# Altium schematic sheet main.SchDoc: SSSSS
size A4; Date: 24.07.2024; Author: Samet Akyol; Revision: 0.1; SheetNumber: 1; SheetTotal: 3
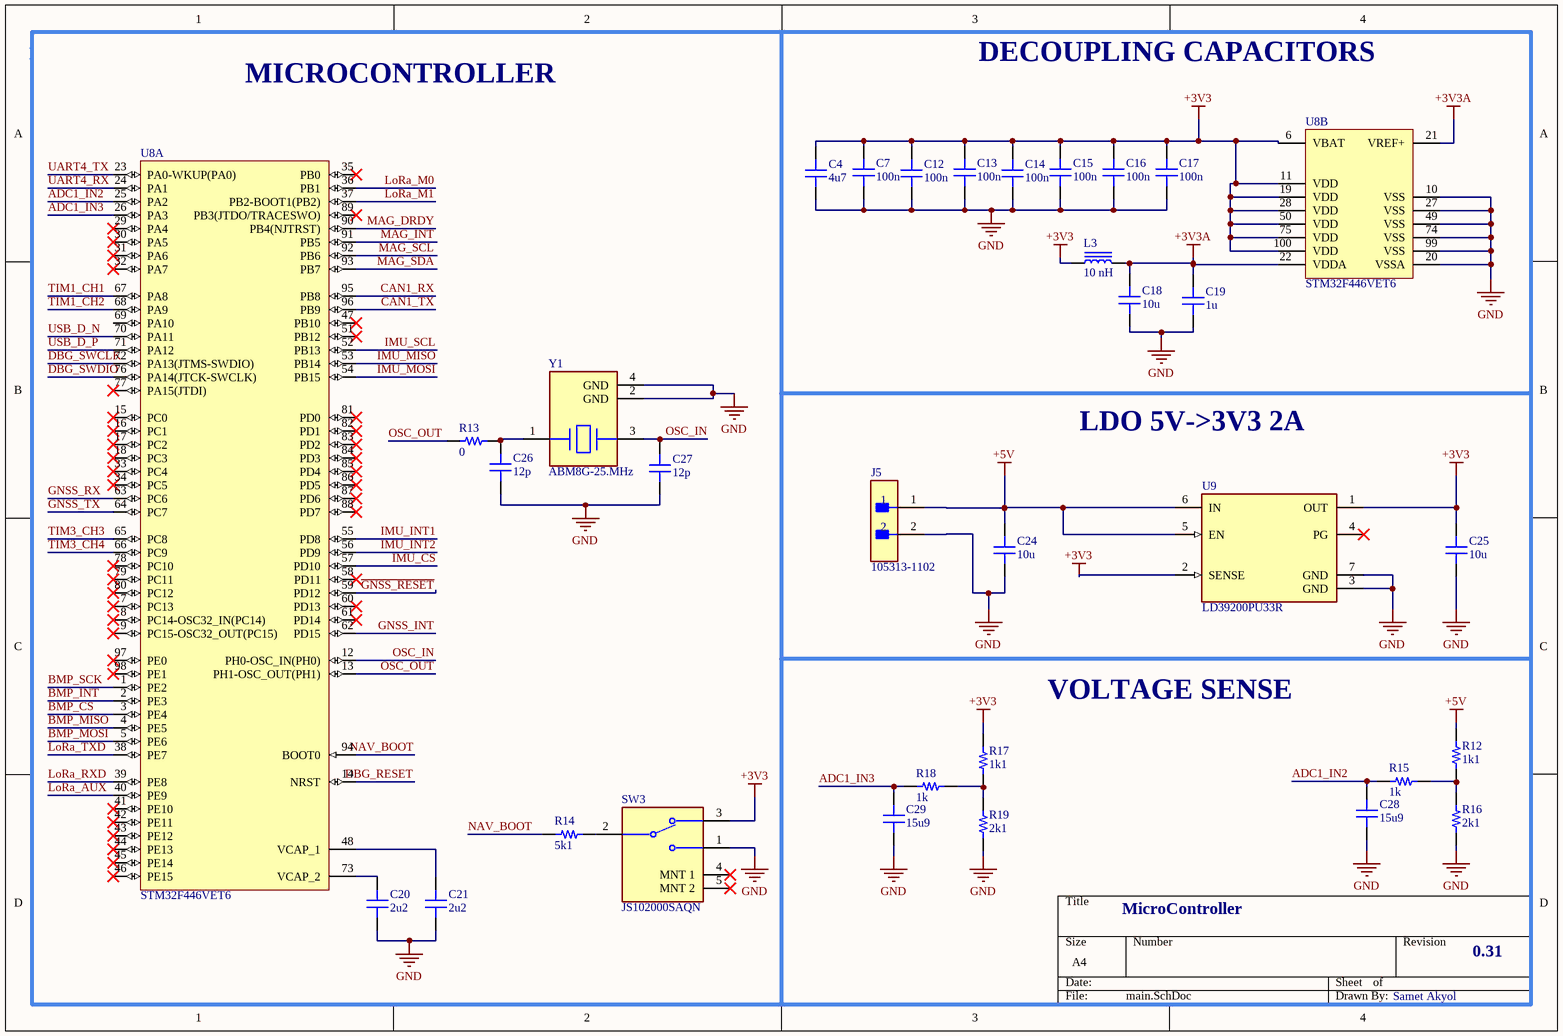
[diagram p0: main.SchDoc]

## Parts
C4  4u7  [CAP 0402_1005]
C7  100n  [CAP 0402_1005]
C12  100n  [CAP 0402_1005]
C13  100n  [CAP 0402_1005]
C14  100n  [CAP 0402_1005]
C15  100n  [CAP 0402_1005]
C16  100n  [CAP 0402_1005]
C17  100n  [CAP 0402_1005]
C18  10u  [CAP 0402_1005]
C19  1u  [CAP 0402_1005]
C20  2u2  [CAP 0402_1005]
C21  2u2  [CAP 0402_1005]
C24  10u  [CAP 0603_1608]
C25  10u  [CAP 0603_1608]
C26  12p  [CAP 0402_1005]
C27  12p  [CAP 0402_1005]
C28  15u9  [CAP 0402_1005]
C29  15u9  [CAP 0402_1005]
J5  105313-1102  [FP-105313-1102-MFG]
L3  10 nH  [IND 0402_1005 RF WW]
R12  1k1  [RES 0402_1005]
R13  0  [RES 0402_1005]
R14  5k1  [RES 0402_1005]
R15  1k  [RES 0402_1005]
R16  2k1  [RES 0402_1005]
R17  1k1  [RES 0402_1005]
R18  1k  [RES 0402_1005]
R19  2k1  [RES 0402_1005]
SW3  JS102000SAQN  [FP-JS102000SAQN-MFG]
U8  STM32F446VET6  [STM-LQFP100_L]  (parts A,B of 2)
U9  LD39200PU33R  [FP-DFN6-7946637-MFG]
Y1  ABM8G-25.MHz  [FP-ABM8G-MFG]

## Nets
+3V3: C4.2 C7.2 C12.2 C13.2 C14.2 C15.2 C16.2 C17.2 C25.2 L3.1 R17.2 SW3.3 U8.6(VBAT) U8.11(VDD) U8.19(VDD) U8.28(VDD) U8.50(VDD) U8.75(VDD) U8.100(VDD) U9.1(OUT) U9.2(SENSE)
+3V3A: C18.2 C19.2 L3.2 U8.21(VREF+) U8.22(VDDA)
+5V: C24.2 J5.1 R12.2 U9.5(EN) U9.6(IN)
GND: C4.1 C7.1 C12.1 C13.1 C14.1 C15.1 C16.1 C17.1 C18.1 C19.1 C20.1 C21.1 C24.1 C25.1 C26.1 C27.1 C28.1 C29.1 J5.2 R16.2 R19.2 SW3.1 U8.10(VSS) U8.20(VSSA) U8.27(VSS) U8.49(VSS) U8.74(VSS) U8.99(VSS) U9.3(GND) U9.7(GND) Y1.2(GND) Y1.4(GND)
ADC1_IN2: C28.2 R15.2 U8.25(PA2)
ADC1_IN3: C29.2 R18.2 U8.26(PA3)
BMP_CS: U8.3(PE4)
BMP_INT: U8.2(PE3)
BMP_MISO: U8.4(PE5)
BMP_MOSI: U8.5(PE6)
BMP_SCK: U8.1(PE2)
CAN1_RX: U8.95(PB8)
CAN1_TX: U8.96(PB9)
DBG_RESET: U8.14(NRST)
DBG_SWCLK: U8.72(PA13(JTMS-SWDIO))
DBG_SWDIO: U8.76(PA14(JTCK-SWCLK))
~{GNSS_RESET}: U8.59(PD12)
GNSS_INT: U8.62(PD15)
GNSS_RX: U8.63(PC6)
GNSS_TX: U8.64(PC7)
IMU_CS: U8.57(PD10)
IMU_INT1: U8.55(PD8)
IMU_INT2: U8.56(PD9)
IMU_MISO: U8.53(PB14)
IMU_MOSI: U8.54(PB15)
IMU_SCL: U8.52(PB13)
LoRa_AUX: U8.40(PE9)
LoRa_M0: U8.36(PB1)
LoRa_M1: U8.37(PB2-BOOT1(PB2))
LoRa_RXD: U8.39(PE8)
LoRa_TXD: U8.38(PE7)
MAG_DRDY: U8.90(PB4(NJTRST))
MAG_INT: U8.91(PB5)
MAG_SCL: U8.92(PB6)
MAG_SDA: U8.93(PB7)
NAV_BOOT: R14.2 U8.94(BOOT0)
OSC_IN: C27.2 U8.12(PH0-OSC_IN(PH0)) Y1.3
OSC_OUT: R13.1 U8.13(PH1-OSC_OUT(PH1))
TIM1_CH1: U8.67(PA8)
TIM1_CH2: U8.68(PA9)
TIM3_CH3: U8.65(PC8)
TIM3_CH4: U8.66(PC9)
UART4_RX: U8.24(PA1)
UART4_TX: U8.23(PA0-WKUP(PA0))
USB_D_N: U8.70(PA11)
USB_D_P: U8.71(PA12)
NetC20_2: C20.2 U8.73(VCAP_2)
NetC21_2: C21.2 U8.48(VCAP_1)
NetC26_2: C26.2 R13.2 Y1.1
NetR12_1: R12.1 R15.1 R16.1
NetR14_1: R14.1 SW3.2(C)
NetR17_1: R17.1 R18.1 R19.1

Not connected (* = marked no-connect by the designer): SW3 4(MNT_1)* 5(MNT_2)*; U8 7(PC13)* 8(PC14-OSC32_IN(PC14))* 9(PC15-OSC32_OUT(PC15))* 15(PC0)* 16(PC1)* 17(PC2)* 18(PC3)* 29(PA4)* 30(PA5)* 31(PA6)* 32(PA7)* 33(PC4)* 34(PC5)* 35(PB0)* 41(PE10)* 42(PE11)* 43(PE12)* 44(PE13)* 45(PE14)* 46(PE15)* 47(PB10)* 51(PB12)* 58(PD11)* 60(PD13)* 61(PD14)* 69(PA10) 77(PA15(JTDI))* 78(PC10)* 79(PC11)* 80(PC12)* 81(PD0)* 82(PD1)* 83(PD2)* 84(PD3)* 85(PD4)* 86(PD5)* 87(PD6)* 88(PD7)* 89(PB3(JTDO/TRACESWO))* 97(PE0)* 98(PE1)*; U9 4(PG)*

## Notes on the sheet
- MICROCONTROLLER
- DECOUPLING CAPACITORS
- LDO 5V->3V3 2A
- VOLTAGE SENSE
- MicroController
- 0.31
- Samet Akyol

## Library data of the parts
C4 C7 C12-C21 C26-C29 = MD0402BB104K100NGHT-EM: CAP CER 0.1UF 10V X7R 0402; manufacturer: Knowles Novacap; Capacitance: 0.1 µF; Tolerance: ±10%; Part Number: MD0402BB104K100NGHT-EM; Applications: Medical, Non-Critical; componentlink1description: Datasheet; componentlink1url: https://mm.digikey.com/Volume0/opasdata/d220001/medias/docus/5546/MD Series R3.pdf; componentlink2description: DigiKey Link; componentlink2url: https://www.digikey.com/en/products/detail/knowles-novacap/MD0402BB104K100NGHT-EM/21406861; Device Package: 0402 (1005 Metric); lastupdated: 9.02.2024 20:03:17; Lifecycle Status: Active; Minimum Order: 1; Mounting Type: Surface Mount, MLCC; Operating Temperature: -55°C ~ 125°C; Package / Case: 0402 (1005 Metric); packaging: TapeAndReel; partid: 56675; price: 1.21; series: MD; Supplier 1: DigiKey; Supplier Part Number 1: 1763-MD0402BB104K100NGHT-EMCT-ND; Temperature Coefficient: X7R; Voltage - Rated: 10V
  C4: Value: 4u7
  C7 C12-C17: Value: 100n
  C18: Value: 10u
  C19: Value: 1u
  C20 C21: Value: 2u2
  C26 C27: Value: 12p
  C28 C29: Value: 15u9
C24 C25 = GRM1885C1H362JA01D: CAP CER 3600PF 50V C0G/NP0 0603; manufacturer: Murata Electronics; Temperature Coefficient: C0G, NP0; Tolerance: ±5%; Part Number: GRM1885C1H362JA01D; Value: 10u; Applications: General Purpose; Capacitance: 3600 pF; componentlink1description: Datasheet; componentlink1url: https://www.murata.com/~/media/webrenewal/support/library/catalog/products/capacitor/mlcc/c02e.ashx?la=en-us; componentlink2description: DigiKey Link; componentlink2url: https://www.digikey.com/en/products/detail/murata-electronics/GRM1885C1H362JA01D/2611163; Device Package: 0603 (1608 Metric); lastupdated: 9.02.2024 20:10:10; Lifecycle Status: Active; Minimum Order: 1; Mounting Type: Surface Mount, MLCC; Operating Temperature: -55°C ~ 125°C; Package / Case: 0603 (1608 Metric); packaging: TapeAndReel; partid: 15929; Part Status: Active; price: 0.01; series: GRM; Size / Dimension: 0.063" L x 0.031" W (1.60mm x 0.80mm); Supplier 1: DigiKey; Supplier Part Number 1: 490-6386-1-ND; Thickness (Max): 0.035" (0.90mm); Voltage - Rated: 50V
J5 = CMP-04776-000341-1: CONN HEADER R/A 2POS 2.5MM
L3 = LQW15AN10NG80D: FIXED IND 10NH 1.4A 0.081OHM SMD; Manufacturer: Murata Electronics; DC Resistance (DCR): 81mOhm Max; Frequency - Self Resonant: 6GHz; Inductance Frequency - Test: 100 MHz; Material - Core: Non-Magnetic; Q @ Freq: 31 @ 250MHz; Shielding: Unshielded; Tolerance: ±2%; Type: Drum Core, Wirewound; Part Number: LQW15AN10NG80D; ComponentLink1Description: Datasheet; ComponentLink1URL: https://search.murata.co.jp/Ceramy/image/img/P02/JELF243A-0100.pdf; ComponentLink2Description: DigiKey Link; ComponentLink2URL: https://www.digikey.com/en/products/detail/murata-electronics/LQW15AN10NG80D/4905881; Current Rating (Amps): 1.4 A; Device Package: 0402 (1005 Metric); Height - Seated (Max): 0.024" (0.60mm); Inductance: 10 nH; LastUpdated: 11.03.2024 07:55:40; Lifecycle Status: Active; Minimum Order: 1; Mounting Type: Surface Mount; Operating Temperature: -55°C ~ 125°C; Package / Case: 0402 (1005 Metric); Packaging: TapeAndReel; PartId: 162; Part Status: Active; Price: 0.07; Series: LQW15; Size / Dimension: 0.039" L x 0.024" W (1.00mm x 0.60mm); Supplier 1: DigiKey; Supplier Part Number 1: 490-14708-1-ND; Value: 10 nH
R12 R14-R19 = RP73PF1E249KBTD: RES 249K OHM 0.1% 1/10W 0402; Manufacturer: TE Connectivity Passive Product; Power (Watts): 0.1W, 1/10W; Resistance: 249 kOhms; Temperature Coefficient: ±25ppm/°C; Part Number: RP73PF1E249KBTD; ComponentLink1Description: Datasheet; ComponentLink1URL: https://www.te.com/commerce/DocumentDelivery/DDEController?Action=srchrtrv&DocNm=1773272&DocType=DS&DocLang=English; ComponentLink2Description: DigiKey Link; ComponentLink2URL: https://www.digikey.com/en/products/detail/te-connectivity-passive-product/RP73PF1E249KBTD/8261091; Composition: Thin Film; Device Package: 0402 (1005 Metric); Height - Seated (Max): 0.014" (0.35mm); LastUpdated: 9.02.2024 20:30:24; Lifecycle Status: Active; Minimum Order: 1; Number of Terminations: 2; Operating Temperature: -55°C ~ 155°C; Package / Case: 0402 (1005 Metric); Packaging: TapeAndReel; PartId: 2418; Part Status: Active; Price: 0.07; Series: RP73, Holsworthy; Size / Dimension: 0.039" L x 0.020" W (1.00mm x 0.50mm); Supplier 1: DigiKey; Supplier Part Number 1: A127549CT-ND; Supplier Device Package: 0402; Tolerance: ±0.1%
  R12 R17: Value: 1k1
  R14: Value: 5k1
  R15 R18: Value: 1k
  R16 R19: Value: 2k1
R13 = RC0402FR-07270RL: RES 270 OHM 1% 1/16W 0402; Manufacturer: Yageo; Power (Watts): 0.063W, 1/16W; Resistance: 270 Ohms; Temperature Coefficient: ±100ppm/°C; Part Number: RC0402FR-07270RL; Value: 0; ComponentLink1Description: Datasheet; ComponentLink1URL: https://www.yageo.com/upload/media/product/productsearch/datasheet/rchip/PYu-RC_Group_51_RoHS_L_10.pdf; ComponentLink2Description: DigiKey Link; ComponentLink2URL: https://www.digikey.com/en/products/detail/yageo/RC0402FR-07270RL/2827584; Composition: Thick Film; Device Package: 0402 (1005 Metric); Features: Moisture Resistant; Height - Seated (Max): 0.016" (0.40mm); LastUpdated: 9.02.2024 20:30:23; Lifecycle Status: Active; Minimum Order: 1; Number of Terminations: 2; Operating Temperature: -55°C ~ 155°C; Package / Case: 0402 (1005 Metric); Packaging: CutTape; PartId: 2573; Part Status: Active; Price: 0.01; Series: RC_L; Size / Dimension: 0.039" L x 0.020" W (1.00mm x 0.50mm); Supplier 1: DigiKey; Supplier Part Number 1: 311-270LRCT-ND; Supplier Device Package: 0402; Tolerance: ±1%
SW3 = CMP-10038-000025-1: SWITCH SLIDE SPDT 1MA 5V; Actuator Material: Nylon; Contact Resistance: 70mR; Electrical Life: 15000Cycles; Actuator Length: 1.5mm; Switch Function: On-On; Actuator Type: Standard; Actuator Color: Black; Current Rating: 1mA; Throw Configuration: SPDT; Termination: Gull Wing; Housing Material: Nylon; Max Operating Temperature: 85°C; Max Voltage Rating (DC): 5V; Voltage Rating (DC): 5V; Contact Plating: Silver; Radiation Hardening: No; Package Quantity: 1; REACH SVHC: No SVHC; RoHS Compliant: Yes; Orientation: Right Angle; Max Current Rating: 1mA; Case/Package: SMD/SMT; Contact Current Rating: 1mA; Contact Material: Copper Alloy; Mount: Surface Mount; Flammability Rating: UL94 V-2; Packaging: Tape and Reel; Switch Travel: 1.5mm; Length: 7.8mm; Series: JS; Min Operating Temperature: -20°C; Depth: 4.82mm
U8 = CMP-0243-00220-1: ARM Cortex-M4 32-bit MCU+FPU, 512 KB Flash, 128 KB Internal RAM, 81 I/Os, 100-Pin LQFP, -40 to 85 degC, Tray; I/Os (High Current): 81; D/A Converter: 2; Internal RAM Size (kB): 128; FLASH Size (Prog) (kB): 512; Supply Voltage(Vcc) min (V): 1.7; Operating Frequency(F) (Processor speed) (MHz): 180; ComponentLink1Description: Manufacturer URL; ComponentLink1URL: http://www.st.com/; Core: ARM Cortex-M4; DatasheetVersion: Rev. 6; ComponentLink2Description: Datasheet; Package Description: LQFP100; Mounting Technology: Surface Mount; Package Reference: 100-Pin Low Profile Quad Flat Package, Body 14 x 14 mm, Pitch 0.5 mm; Packing: Tray; ComponentLink2URL: http://www.st.com/st-web-ui/static/active/en/resource/technical/document/datasheet/DM00141306.pdf
U9 = CMP-12153-000011-1: IC REG LINEAR 3.3V 2A 6DFN; Number of Outputs: 1; Max Input Voltage: 6V; Output Type: Fixed; Min Input Voltage: 1.25V; Dropout Voltage: 130mV; Operating Supply Current: 1mA; Number of Regulators: 1; Case/Package: DFN; Packaging: Tape and Reel; Output Current: 2A; Min Operating Temperature: -40°C; Mount: Surface Mount; Output Voltage: 3.3V; Max Operating Temperature: 125°C; Lead Free: Lead Free; Package Quantity: 3000
Y1 = CMP-2000-05733-3: Crystal 25MHz ±20ppm (Tol) ±30ppm (Stability) 18pF FUND 60Ω 4-Pin SMD T/R; Series Resistance: 60R; Length: 3.2mm; Depth: 2.5mm; Packaging: Tape and Reel; Min Operating Temperature: -40°C; Operating Frequency: 25 MHz; Lead Free: Lead Free; Number of Pins: 4; Frequency Tolerance: 20ppm; Radiation Hardening: No; Max Operating Temperature: 85°C; Termination: SMD/SMT; Frequency Stability: 30ppm; Frequency: 25MHz; Series: ABM8G; Mount: Surface Mount; Package Quantity: 1000; Height: 0.039inch; Width: 0.098inch; Case/Package: CSMD; ESR (Equivalent Series Resistance): 60R; Load Capacitance: 18pF; Tolerance: 20ppm